# Altium schematic sheet bmp280_i2c.SchDoc
size A4
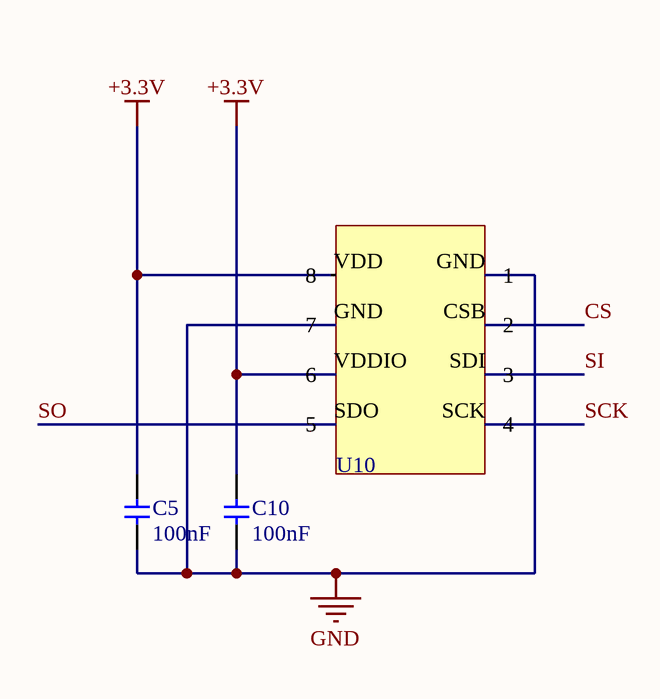
[diagram p0: bmp280_i2c.SchDoc]

## Parts
C5  value 100nF  [0805]  (hidden comment: Generic Capacitor)
C10  value 100nF  [0805]  (hidden comment: Generic Capacitor)
U10  BMP280  [bmp280_i2c]  (value not drawn)

## Nets
+3.3V: C5.1 C10.1 U10.VDD(8) U10.VDDIO(6)
GND: C5.2 C10.2 U10.GND(7)
CS: U10.CSB(2)
SCK: U10.SCK(4)
SI: U10.SDI(3)
SO: U10.SDO(5)

## Library data of the parts
C5 C10 = Capacitor